# EAGLE schematic Jeep_BT_Switcher (EAGLE 7.4.0)
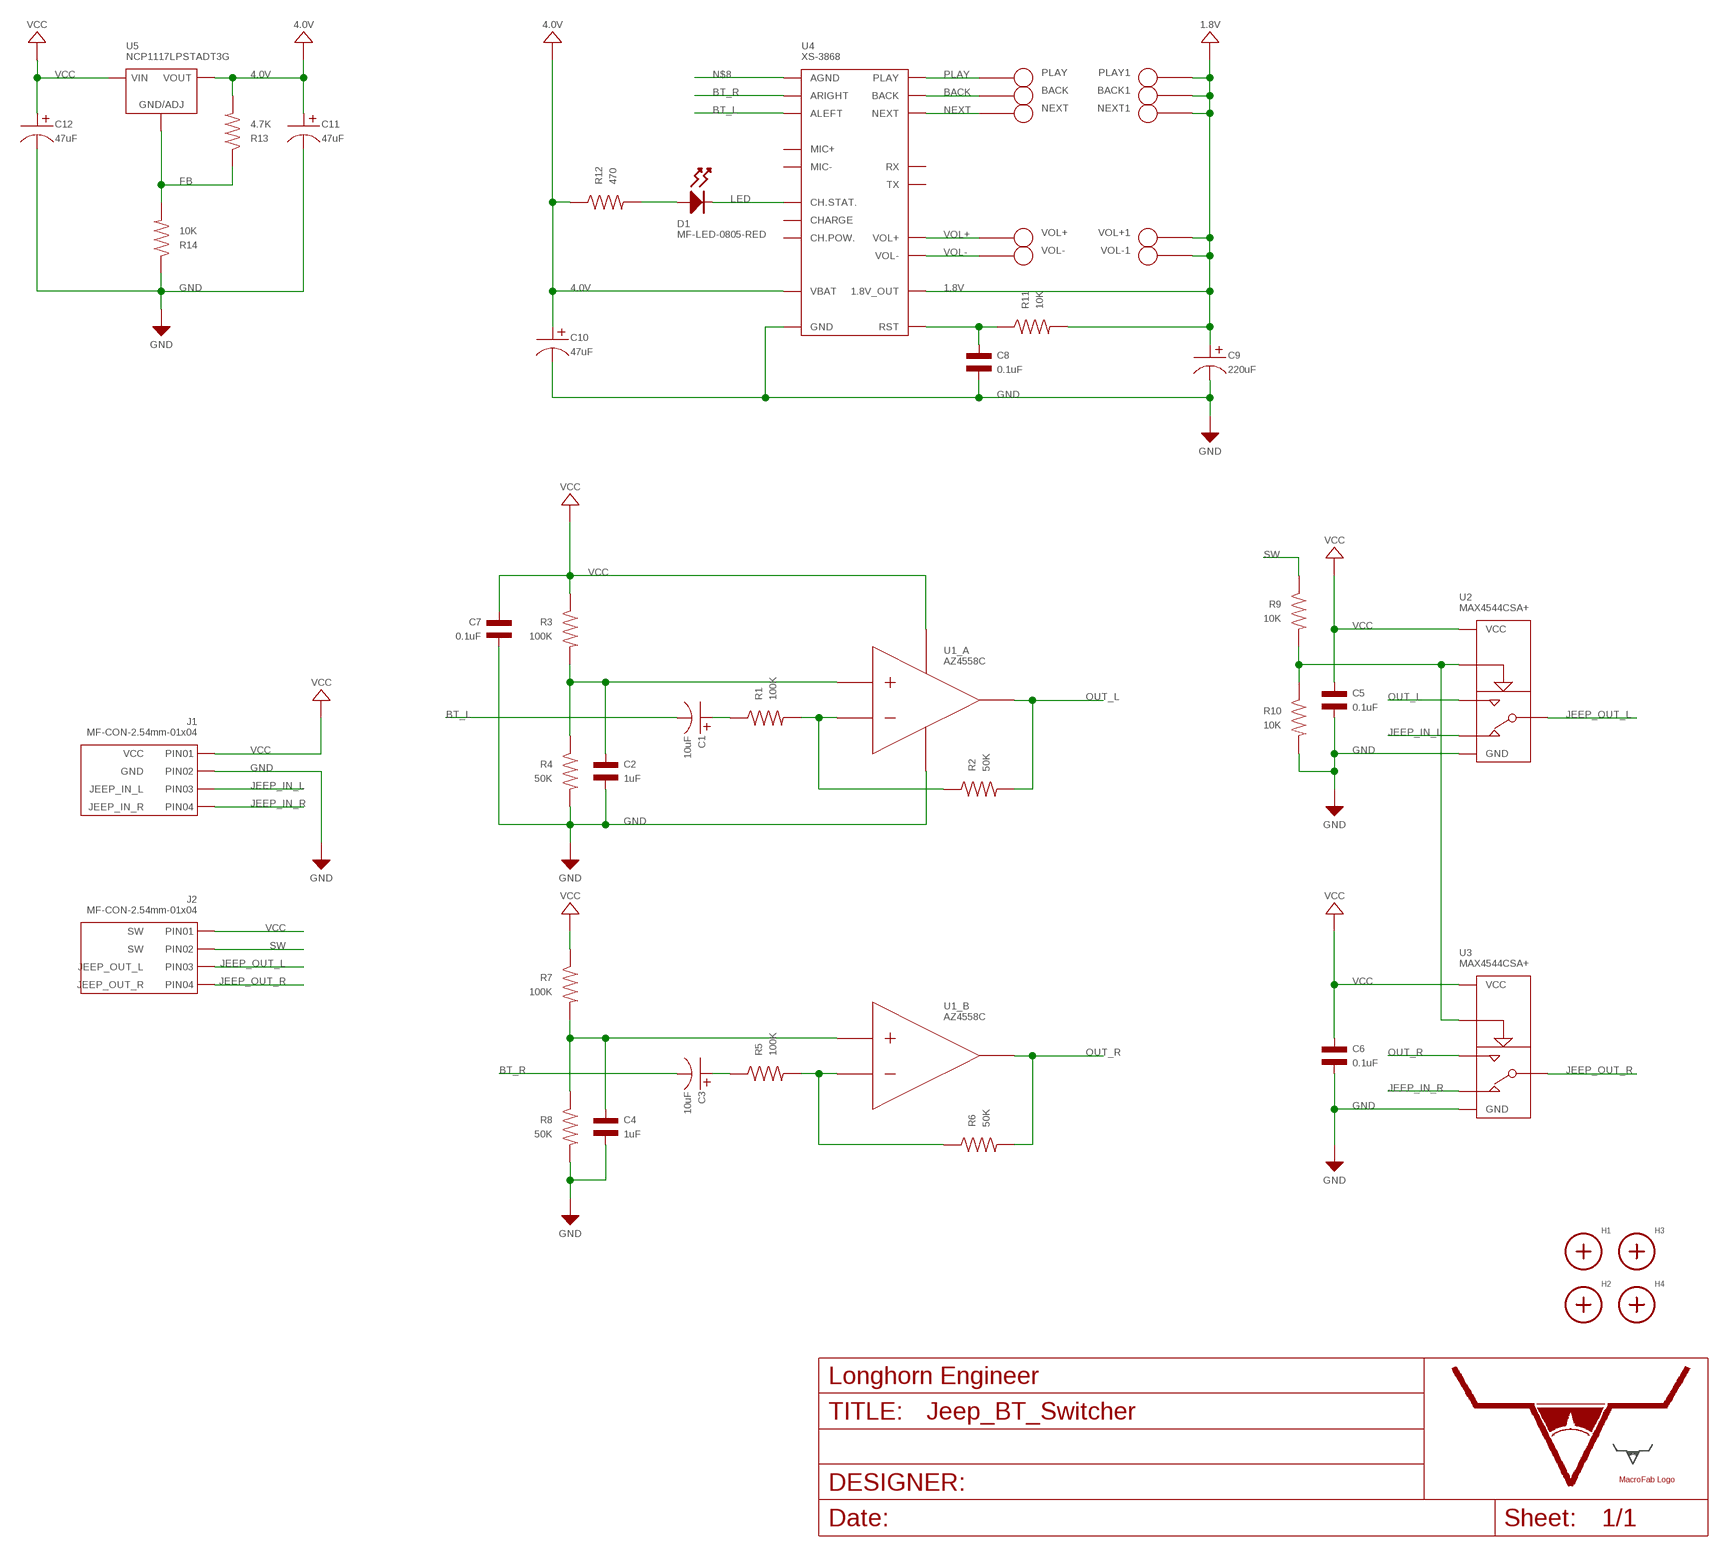
[diagram p0: schematic, sheet 1]

## Parts
BACK  TEST_POINT_SINGLE_ROUND_1MM  [ROUND_TP]
BACK1  TEST_POINT_SINGLE_ROUND_1MM  [ROUND_TP]
C1  10uF  CAPACITOR_P_4MM  [CP4MM]
C2  1uF  CAPACITOR_NP_0805  [C0805]
C3  10uF  CAPACITOR_P_4MM  [CP4MM]
C4  1uF  CAPACITOR_NP_0805  [C0805]
C5  0.1uF  CAPACITOR_NP_0805  [C0805]
C6  0.1uF  CAPACITOR_NP_0805  [C0805]
C7  0.1uF  CAPACITOR_NP_0805  [C0805]
C8  0.1uF  CAPACITOR_NP_0805  [C0805]
C9  220uF  CAPACITOR_P_10MM  [CP10MM]
C10  47uF  CAPACITOR_P_6.3MM  [CP6.3MM]
C11  47uF  CAPACITOR_P_6.3MM  [CP6.3MM]
C12  47uF  CAPACITOR_P_6.3MM  [CP6.3MM]
D1  MF-LED-0805-RED  LED_SINGLE-0805-RED  [LED0805]
H1  MOUNT_HOLE150MIL  [MOUNT_HOLE_150MIL]
H2  MOUNT_HOLE150MIL  [MOUNT_HOLE_150MIL]
H3  MOUNT_HOLE150MIL  [MOUNT_HOLE_150MIL]
H4  MOUNT_HOLE150MIL  [MOUNT_HOLE_150MIL]
J1  MF-CON-2.54mm-01x04  CON_01X04_PTH_2.54MM  [PTH_2.54MM_01X04]
J2  MF-CON-2.54mm-01x04  CON_01X04_PTH_2.54MM  [PTH_2.54MM_01X04]
NEXT  TEST_POINT_SINGLE_ROUND_1MM  [ROUND_TP]
NEXT1  TEST_POINT_SINGLE_ROUND_1MM  [ROUND_TP]
PLAY  TEST_POINT_SINGLE_ROUND_1MM  [ROUND_TP]
PLAY1  TEST_POINT_SINGLE_ROUND_1MM  [ROUND_TP]
R1  100K  RESISTOR_0805  [R0805]
R2  50K  RESISTOR_0805  [R0805]
R3  100K  RESISTOR_0805  [R0805]
R4  50K  RESISTOR_0805  [R0805]
R5  100K  RESISTOR_0805  [R0805]
R6  50K  RESISTOR_0805  [R0805]
R7  100K  RESISTOR_0805  [R0805]
R8  50K  RESISTOR_0805  [R0805]
R9  10K  RESISTOR_0805  [R0805]
R10  10K  RESISTOR_0805  [R0805]
R11  10K  RESISTOR_0805  [R0805]
R12  470  RESISTOR_0805  [R0805]
R13  4.7K  RESISTOR_0805  [R0805]
R14  10K  RESISTOR_0805  [R0805]
U1  AZ4558C  [AZ4558C_SOIC-8]
U2  MAX4544CSA+  MAX4544  [AZ4558C_SOIC-8]
U3  MAX4544CSA+  MAX4544  [AZ4558C_SOIC-8]
U4  XS-3868  XS3868  [XS3868]
U5  NCP1117LPSTADT3G  [SOT-223-3]
U$11  LHE_FRAME  [LHE_FRAME]
U$12  MF_LOGOLOGO_SMALL  [MF_LOGO_SMALL]
U$13  LHE_LOGOLHE_LOGO  [LHE_LOGO]
VOL+  TEST_POINT_SINGLE_ROUND_1MM  [ROUND_TP]
VOL+1  TEST_POINT_SINGLE_ROUND_1MM  [ROUND_TP]
VOL-  TEST_POINT_SINGLE_ROUND_1MM  [ROUND_TP]
VOL-1  TEST_POINT_SINGLE_ROUND_1MM  [ROUND_TP]

## Nets
1.8V: BACK1.P$1 C9.P$1 NEXT1.P$1 PLAY1.P$1 R11.P$2 U4.1.8V_OUT VOL+1.P$1 VOL-1.P$1
4.0V: C10.P$1 C11.P$1 R12.P$1 R13.P$2 U4.VBAT U5.P$1(VOUT) U5.P$3(VOUT)
BACK: BACK.P$1 U4.BACK
BT_L: C1.P$2 U4.ALEFT
BT_R: C3.P$2 U4.ARIGHT
FB: R13.P$1 R14.P$2 U5.P$2(GND/ADJ)
GND: C2.P$2 C4.P$2 C5.P$2 C6.P$2 C7.P$2 C8.P$2 C9.P$2 C10.P$2 C11.P$2 C12.P$2 J1.P$2(PIN2) R4.P$2 R8.P$2 R10.P$2 R14.P$1 U1.4(_A:VEE) U2.4(GND) U3.4(GND) U4.GND
JEEP_IN_L: J1.P$3(PIN3) U2.3(NC)
JEEP_IN_R: J1.P$4(PIN4) U3.3(NC)
JEEP_OUT_L: J2.P$3(PIN3) U2.2(COM)
JEEP_OUT_R: J2.P$4(PIN4) U3.2(COM)
LED: D1.CATHODE U4.CH.STAT.
N$1: R1.P$2 R2.P$1 U1.2(_A:INPUT_1-)
N$2: R5.P$2 R6.P$1 U1.6(_B:INPUT_2-)
N$3: C1.P$1 R1.P$1
N$4: C2.P$1 R3.P$2 R4.P$1 U1.3(_A:INPUT_1+)
N$5: C3.P$1 R5.P$1
N$6: C4.P$1 R7.P$2 R8.P$1 U1.5(_B:INPUT_2+)
N$7: R9.P$2 R10.P$1 U2.7(IN) U3.7(IN)
N$8: U4.AGND
N$10: D1.ANODE R12.P$2
NEXT: NEXT.P$1 U4.NEXT
OUT_L: R2.P$2 U1.1(_A:OUTPUT_1) U2.1(NO)
OUT_R: R6.P$2 U1.7(_B:OUTPUT_2) U3.1(NO)
PLAY: PLAY.P$1 U4.PLAY
RST: C8.P$1 R11.P$1 U4.RST
SW: J2.P$2(PIN2) R9.P$1
VCC: C5.P$1 C6.P$1 C7.P$1 C12.P$1 J1.P$1(PIN1) J2.P$1(PIN1) R3.P$1 R7.P$1 U1.8(_A:VCC) U2.8(VCC) U3.8(VCC) U5.P$4(VIN)
VOL+: U4.VOL+ VOL+.P$1
VOL-: U4.VOL- VOL-.P$1
Unconnected: U4.CH.POW. U4.CHARGE U4.MIC+ U4.MIC- U4.RX U4.TX

## Library data of the parts
BACK BACK1 NEXT NEXT1 PLAY PLAY1 VOL+ VOL+1 VOL- VOL-1 = PP_Connectors:TEST_POINT_SINGLE; POPULATE: 1
C1 C3 C9-C12 = MF_Passives:CAPACITOR_P: Library: MF_Passives Description: Device for Polarized Capacitors. Manufacture part number (MPN), Voltage Rating, and Tolerance can be added via Attributes. Check https://factory.macrofab.com/parts for the house parts list.; POPULATE: 1
C2 C4-C8 = MF_Passives:CAPACITOR_NP: Library: MF_Passives Description: Device for Non-Polarized Capacitors. Manufacture part number (MPN) can be added via Attributes. Check https://factory.macrofab.com/parts for the house parts list.; POPULATE: 1
D1 = MF_LEDs:LED_SINGLE: Library: MF_LEDs Description: Device for Single LED Packages. Manufacture part number (MFG#) can be added via Attributes.; HOUSEPART: YES; MPN: MF-LED-0805-RED; POPULATE: 1; URL: https://factory.macrofab.com/part/MF-LED-0805-RED
H1-H4 = PP_Connectors:MOUNT_HOLE; POPULATE: 1
J1 = MF_Connectors:CON_01X04: Library: MF_Connectors Description: Header Connector with 04 Positions and 01 Rows. Use the LABEL Attribute to label the pin on the schematic and PCB. You can remove the attributes on the PCB by using the SMASH function on the part and then deleting the text.; HOUSEPART: YES; LABEL01: VCC; LABEL02: GND; LABEL03: JEEP_IN_L; LABEL04: JEEP_IN_R; MPN: MF-CON-2.54mm-01x04; POPULATE: 1; URL: https://factory.macrofab.com/part/MF-CON-2.54mm-01x04
J2 = MF_Connectors:CON_01X04: Library: MF_Connectors Description: Header Connector with 04 Positions and 01 Rows. Use the LABEL Attribute to label the pin on the schematic and PCB. You can remove the attributes on the PCB by using the SMASH function on the part and then deleting the text.; HOUSEPART: YES; LABEL01: SW; LABEL02: SW; LABEL03: JEEP_OUT_L; LABEL04: JEEP_OUT_R; MPN: MF-CON-2.54mm-01x04; POPULATE: 1; URL: https://factory.macrofab.com/part/MF-CON-2.54mm-01x04
R1-R14 = MF_Passives:RESISTOR: Library: MF_Passives Description: Device for Resistors. Manufacture part number (MPN), Voltage, Tolerance, and Wattage Rating can be added via Attributes. Check https://factory.macrofab.com/parts for the house parts list.; POPULATE: 1
U1 = PP_AnalogIC:AZ4558C
U2 U3 = PP_AnalogIC:MAX4544
U4 = PP_Sensors:XS3868
U5 = MF_IC_Power:NCP1117LP: Manufacturer Part #: NCP1117LP Manufacturer: ON Semiconductor Description: LDO Voltage Regulators; HOUSEPART: NO; MPN: NCP1117LPSTADT3G; POPULATE: 1; URL: http://www.onsemi.com/pub_link/Collateral/NCP1117LP-D.PDF
U$11 = PP_Aesthetics:LHE_FRAME; DNAME: Parker Dillmann; REVNUM: REV: 3
U$12 = PP_Aesthetics:MF_LOGO
U$13 = PP_Aesthetics:LHE_LOGO